# EAGLE design Variable Voltage (EAGLE 9.6.2)
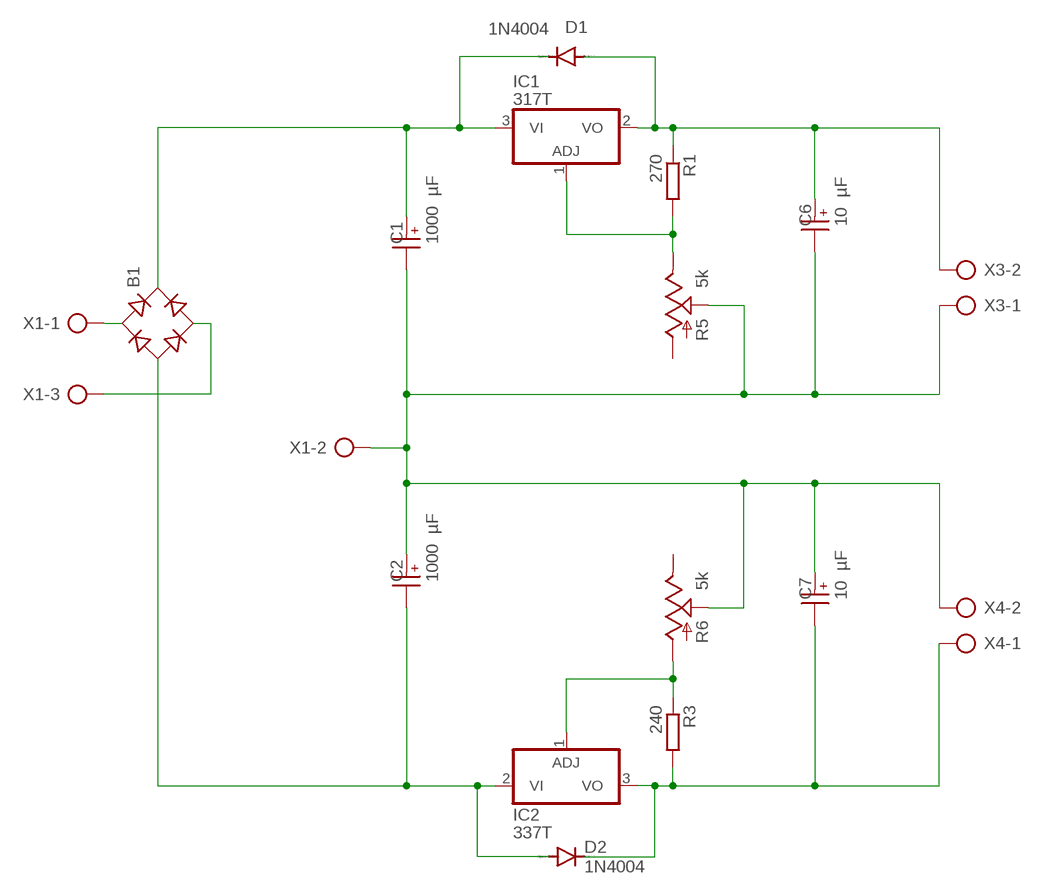
[diagram p0: schematic, sheet 1]

## Parts
B1  RB1A  [RB1A]
C1  1000 µF  WCAP-ATG8_10X12.5_860010275016  [WCAP-ATG8_10X12.5(DXL)]
C2  1000 µF  WCAP-ATG8_10X12.5_860010275016  [WCAP-ATG8_10X12.5(DXL)]
C6  10 µF  WCAP-ATG8_5X11_860010772009  [WCAP-ATG8_5X11(DXL)]
C7  10 µF  WCAP-ATG8_5X11_860010772009  [WCAP-ATG8_5X11(DXL)]
D1  1N4004  [DO41-10]
D2  1N4004  [DO41-10]
IC1  317T  [TO220H]
IC2  337T  [TO220H]
R1  270  R-EU_0204/7  [0204/7]
R3  240  R-EU_0204/7  [0204/7]
R5  5k  TRIM_US-CA9V  [CA9V]
R6  5k  TRIM_US-CA9V  [CA9V]
X1  AK300/3  [AK300/3]
X3  AK300/2  [AK300/2]
X4  AK300/2  [AK300/2]

## Nets
GND: C1.2(-) C2.1(+) C6.2(-) C7.1(+) R5.S R6.S X1.2 X3.1 X4.2
N$1: B1.AC1 X1.1
N$2: B1.AC2 X1.3
N$3: B1.+ C1.1(+) D1.C IC1.3(VI)
N$4: B1.- C2.2(-) D2.A IC2.2(VI)
N$6: IC2.1(ADJ) R3.1 R6.A
N$7: C7.2(-) D2.C IC2.3(VO) R3.2 X4.1
N$8: C6.1(+) D1.A IC1.2(VO) R1.1 X3.2
N$13: IC1.1(ADJ) R1.2 R5.E
Unconnected: R5.A R6.E

## Library data of the parts
B1 = rectifier:RB1A: RECTIFIER 1 A
C1 C2 = Aluminium Electrolyt Capacitors:WCAP-ATG8_10X12.5: WCAP-ATG8 Aluminium Electrolytic Capacitors General Purpose +85 °C Characteristics General purpose product series with max. operating temperature of +85 °C Wide range of capacitance value Mounting style: THT Radial Capacitance range: 0.1 µF ‒ 33000 µF Capacitance tolerance: ±20 % Voltage range (UR): 10 ‒ 400 V(DC) Operating temperature: -40 °C up to +85 °C for UR < 400 V(DC) -25 °C up to +85 °C for UR ≥ 400 V(DC) Endurance: 2000 h @ +85 °C Dimensions (DxL) in mm: 5.0 x 11.0 up to 22.0 x 51.0 Recommended soldering: Wave soldering Applications Filtering Smoothing Energy storage Coupling <https://www.we-online.com/catalog/media/o35732v209%20WCAP-ATG8_4C.jpg> Details see: https://www.we-online.com/catalog/en/WCAP-ATG8/ Updated by yingchun,Shan;2020-02-27 2020(C) Würth Elektronik; DATASHEET-URL: https://www.we-online.com/catalog/datasheet/860010275016.pdf; DF: 19%; DIAMETER: 10mm; I-LEAK: 100uA; I-RIPPLE: 726mA; L: 12.5mm; OPERATING-TEMPERATURE: -40 °C up to +85 °C; PART-NUMBER: 860010275016; PITCH: 5mm; TECHNICAL-REFERENCE: ATBF125102M010DSPA9B000; VR: 10V(DC)
C6 C7 = Aluminium Electrolyt Capacitors:WCAP-ATG8_5X11: WCAP-ATG8 Aluminium Electrolytic Capacitors General Purpose +85 °C Characteristics General purpose product series with max. operating temperature of +85 °C Wide range of capacitance value Mounting style: THT Radial Capacitance range: 0.1 µF ‒ 33000 µF Capacitance tolerance: ±20 % Voltage range (UR): 10 ‒ 400 V(DC) Operating temperature: -40 °C up to +85 °C for UR < 400 V(DC) -25 °C up to +85 °C for UR ≥ 400 V(DC) Endurance: 2000 h @ +85 °C Dimensions (DxL) in mm: 5.0 x 11.0 up to 22.0 x 51.0 Recommended soldering: Wave soldering Applications Filtering Smoothing Energy storage Coupling <https://www.we-online.com/catalog/media/o35732v209%20WCAP-ATG8_4C.jpg> Details see: https://www.we-online.com/catalog/en/WCAP-ATG8/ Updated by yingchun,Shan;2020-02-27 2020(C) Würth Elektronik; DATASHEET-URL: https://www.we-online.com/catalog/datasheet/860010772009.pdf; DF: 9%; DIAMETER: 5mm; I-LEAK: 6.3uA; I-RIPPLE: 77mA; L: 11mm; OPERATING-TEMPERATURE: -40 °C up to +85 °C; PART-NUMBER: 860010772009; PITCH: 2mm; TECHNICAL-REFERENCE: ATBC110100M063DSPA3B000; VR: 63V(DC)
D1 D2 = diode:1N4004: DIODE general purpose rectifier, 1 A
IC1 = linear:*317: Positive VOLTAGE REGULATOR
IC2 = linear:*337: Negative VOLTAGE REGULATOR
R1 R3 = rcl:R-EU_: RESISTOR, European symbol; SPICEPREFIX: R
R5 R6 = pot:TRIM_US-: POTENTIOMETER
X1 = con-ptr500:AK300/3: CONNECTOR; OC_FARNELL: unknown; OC_NEWARK: unknown
X3 X4 = con-ptr500:AK300/2: CONNECTOR; OC_FARNELL: unknown; OC_NEWARK: unknown

## Board
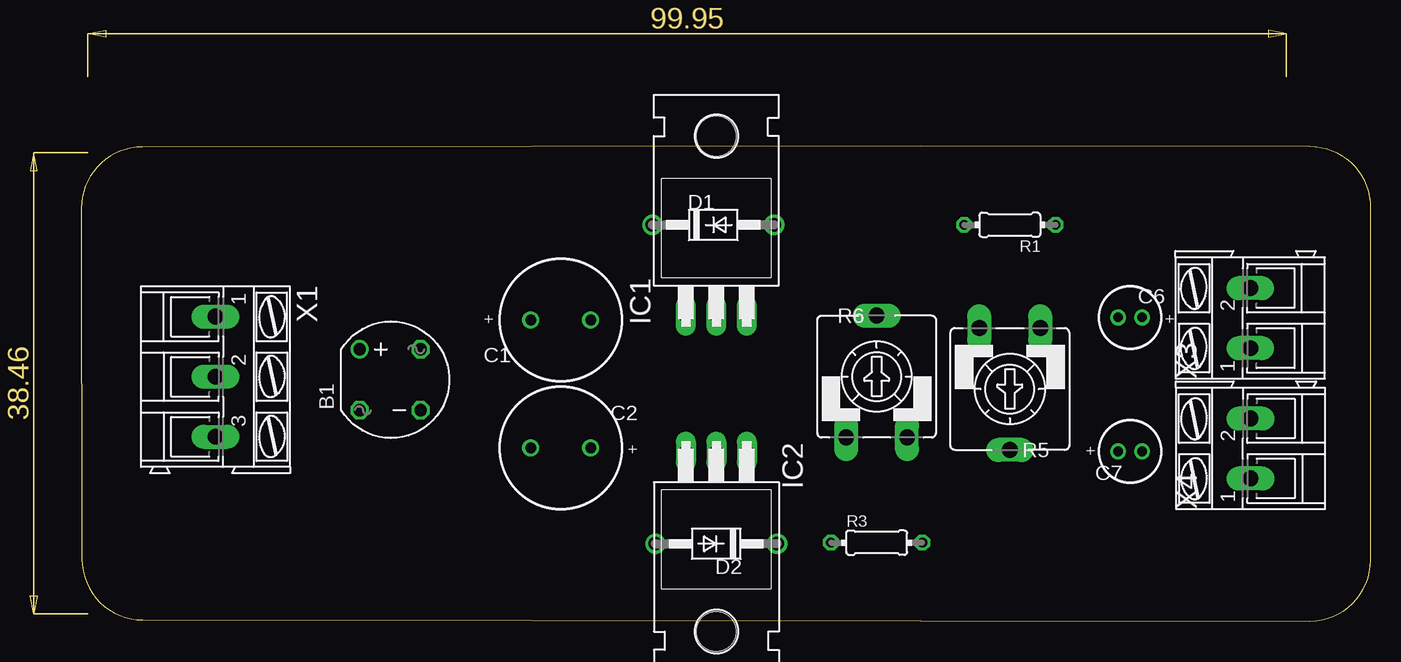
[diagram p1: board, top side]
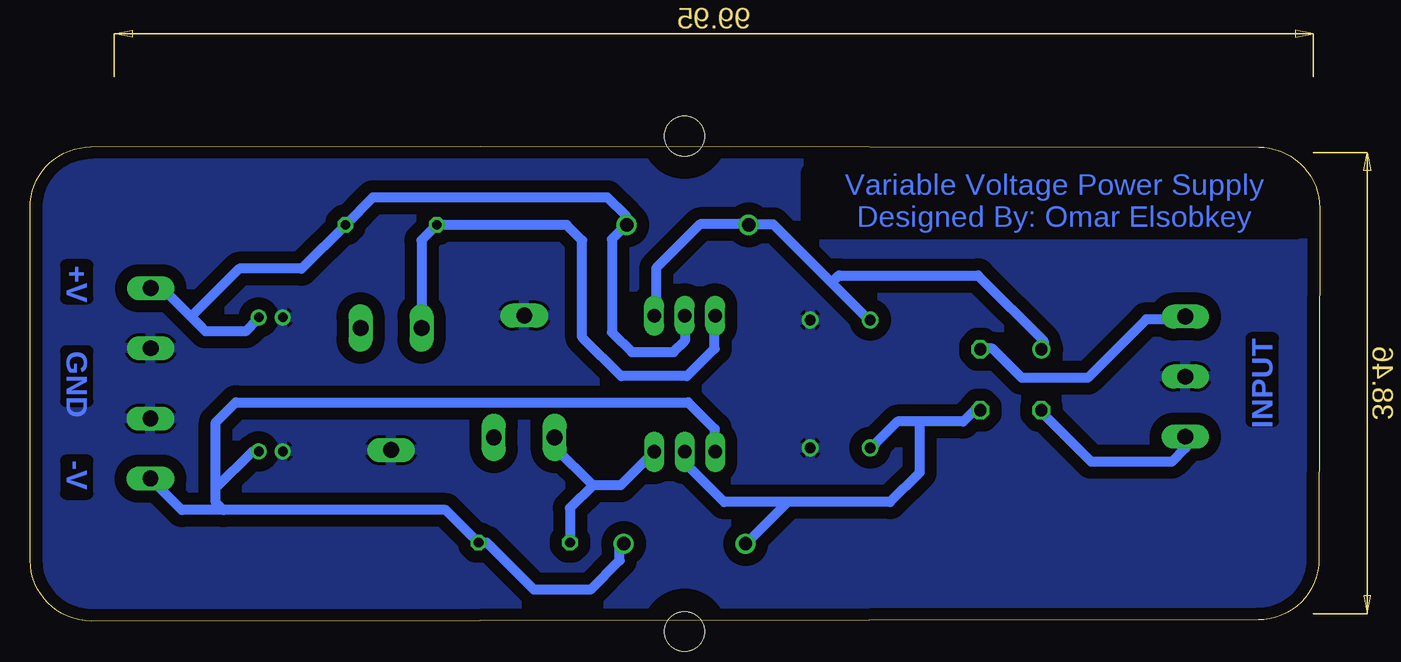
[diagram p2: board, bottom side, seen from below]

Size 107.51 x 39.6 mm. Coordinates in mm from the lower left corner, seen from the top.
Outline: 0,34.44 0.06,5.17 arc90 5.13,0.1 102.41,0 arc90 107.49,5.08 107.51,34.46 arc90 102.43,39.55 69.94,39.6 5.08,39.53 arc90 0,34.44
Copper layers (1*16): Top 0.035mm / dielectric 1.5mm / Bottom 0.035mm
Design rules "default *": minimum track width 32mil, minimum drill 0.35mm, track to track 16mil, track to pad 16mil, pad to pad 6mil, via to via 6mil, smd to smd 6mil, copper to edge 40mil, drill to drill 6mil, minimum pad ring 10mil, minimum via ring 8mil, stop-mask expansion 4mil, vias tented up to drill 0mil, thermal gap 10mil

### Footprints (pad centres in the part's own frame; a part is rotated, then mirrored left to right if it is on the bottom)
RB1A = drill 1.016: + -2.54,2.54 | drill 1.016 octagon: - 2.54,-2.54; AC1 2.54,2.54; AC2 -2.54,-2.54
WCAP-ATG8_10X12.5(DXL) = drill 0.9: 1 2.5,0; 2 -2.5,0
WCAP-ATG8_5X11(DXL) = drill 0.8: 1 1,0; 2 -1,0
DO41-10 = drill 1.118: A 5.08,0; C -5.08,0
TO220H = drill 1.118 long: 1 -2.54,-10.16; 2 0,-10.16; 3 2.54,-10.16 | hole 3.302: 0,4.826
0204/7 = drill 0.813 octagon: 1 -3.81,0; 2 3.81,0
CA9V = drill 1.321 long: A -2.54,-5.08; E 2.54,-5.08; S 0,5.08
AK300/3 = drill 1.321 long: 1 -5.004,0; 2 0,0; 3 5.004,0
AK300/2 = drill 1.321 long: 1 -2.515,0; 2 2.489,0

### Placement (x,y rotation side)
B1  25.75,20.13 0 top
C1  39.97,25.12 180 top
C2  39.97,14.45 0 top
C6  87.44,25.32 0 top
C7  87.44,14.15 180 top
D1  52.69,33.04 0 top
D2  52.94,6.45 180 top
IC1  52.94,35.62 0 top
IC2  52.94,3.95 180 top
R1  77.41,33.04 180 top
R3  66.31,6.54 0 top
R5  77.41,19.35 180 top
R6  66.31,20.39 0 top
X1  11.19,20.38 270 top
X3  97.45,25.27 90 top
X4  97.48,14.4 90 top

### Tracks (layer width: path | path; a pad name or v marks a point on that pad's centre or on a via)
GND
  pour Bottom (isolate 1.016): 0.52,39.01 107.05,39.01 107.05,0.56 0.52,0.56 0.52,0.61
N$1
  Bottom 0.813: B1.AC1 27.88,22.73 27.27,22.73 24.83,20.29 19.34,20.29 14.47,25.17 11.42,25.17 X1.1
N$2
  Bottom 0.813: X1.3 11.19,14.43 12.34,13.28 19.04,13.28 23,17.24 B1.AC2
N$3
  Bottom 0.813: 40.68,28.22 45.56,33.09 47.39,33.09 D1.C 48,33.09 51.65,33.09 55.31,29.44 55.31,25.78 IC1.3 | 40.68,28.22 37.63,25.17 C1.1 | 40.68,28.22 40.07,28.83 28.49,28.83 23,23.34 23,22.73 B1.+
N$4
  Bottom 0.813: 33.37,16.63 29.71,16.63 28.49,17.85 B1.- | 33.37,16.63 35.2,16.63 37.02,14.81 C2.2 | 44.34,9.93 47.39,6.88 D2.A | 44.34,9.93 35.8,9.93 33.37,12.37 33.37,16.63 | IC2.2 53,14.05 53,13.28 49.65,9.93 44.34,9.93
N$6
  Bottom 0.813: 62.5,7 R3.1 62.5,9.42 60.59,11.33 | IC2.1 55.68,14.11 | 55.79,14.31 55.69,14.31 IC2.1 | IC2.1 58.27,11.33 60.59,11.33 | 60.59,11.33 63.77,14.5 R6.A
N$7
  Bottom 0.813: 92.02,11.1 88.97,14.14 C7.2 | 92.02,11.1 92.02,9.88 91.41,9.27 | 97.37,11.89 X4.1 94.86,9.27 91.41,9.27 | 92.02,11.1 92.02,16.58 90.36,18.23 52.64,18.23 50.44,16.03 50.44,14.2 IC2.3 | D2.C 58.36,6.27 58.36,5.05 60.8,2.61 65.5,2.61 69.42,6.54 R3.2 72.85,9.27 91.41,9.27
N$8
  Bottom 0.813: IC1.2 52.92,25.43 52.92,23.37 53.86,22.43 57.34,22.43 58.99,24.08 58.99,31.85 58.36,32.48 D1.A 57.8,33.05 57.8,33.75 59.38,35.33 78.93,35.33 R1.1 84.88,29.39 90.06,29.39 94.06,25.39 93.21,24.53 93.23,24.51 | C6.1 88.44,25.26 89.55,24.15 92.88,24.15 93.23,24.51 | X3.2 96.48,27.76 93.23,24.51
N$13
  Bottom 0.813: IC1.1 50.44,25.17 50.44,22.73 52.75,20.42 58.23,20.42 61.47,23.66 61.47,31.73 62.78,33.04 R1.2 74.87,31.77 R5.E
NAMES
  pour Bottom (isolate 0.508): 101.16,30.91 105.98,30.91 105.98,9.32 101.16,9.32
NAMES1
  pour Bottom (isolate 0.508): 2.38,24.86 7.2,24.86 7.2,15.21 2.38,15.21

### Text on the board
Bottom: Variable Voltage Power Supply / Designed By: Omar Elsobkey | +V | INPUT | GND | -V